# Altium schematic sheet 02_H3CORE.SchDoc
size A2
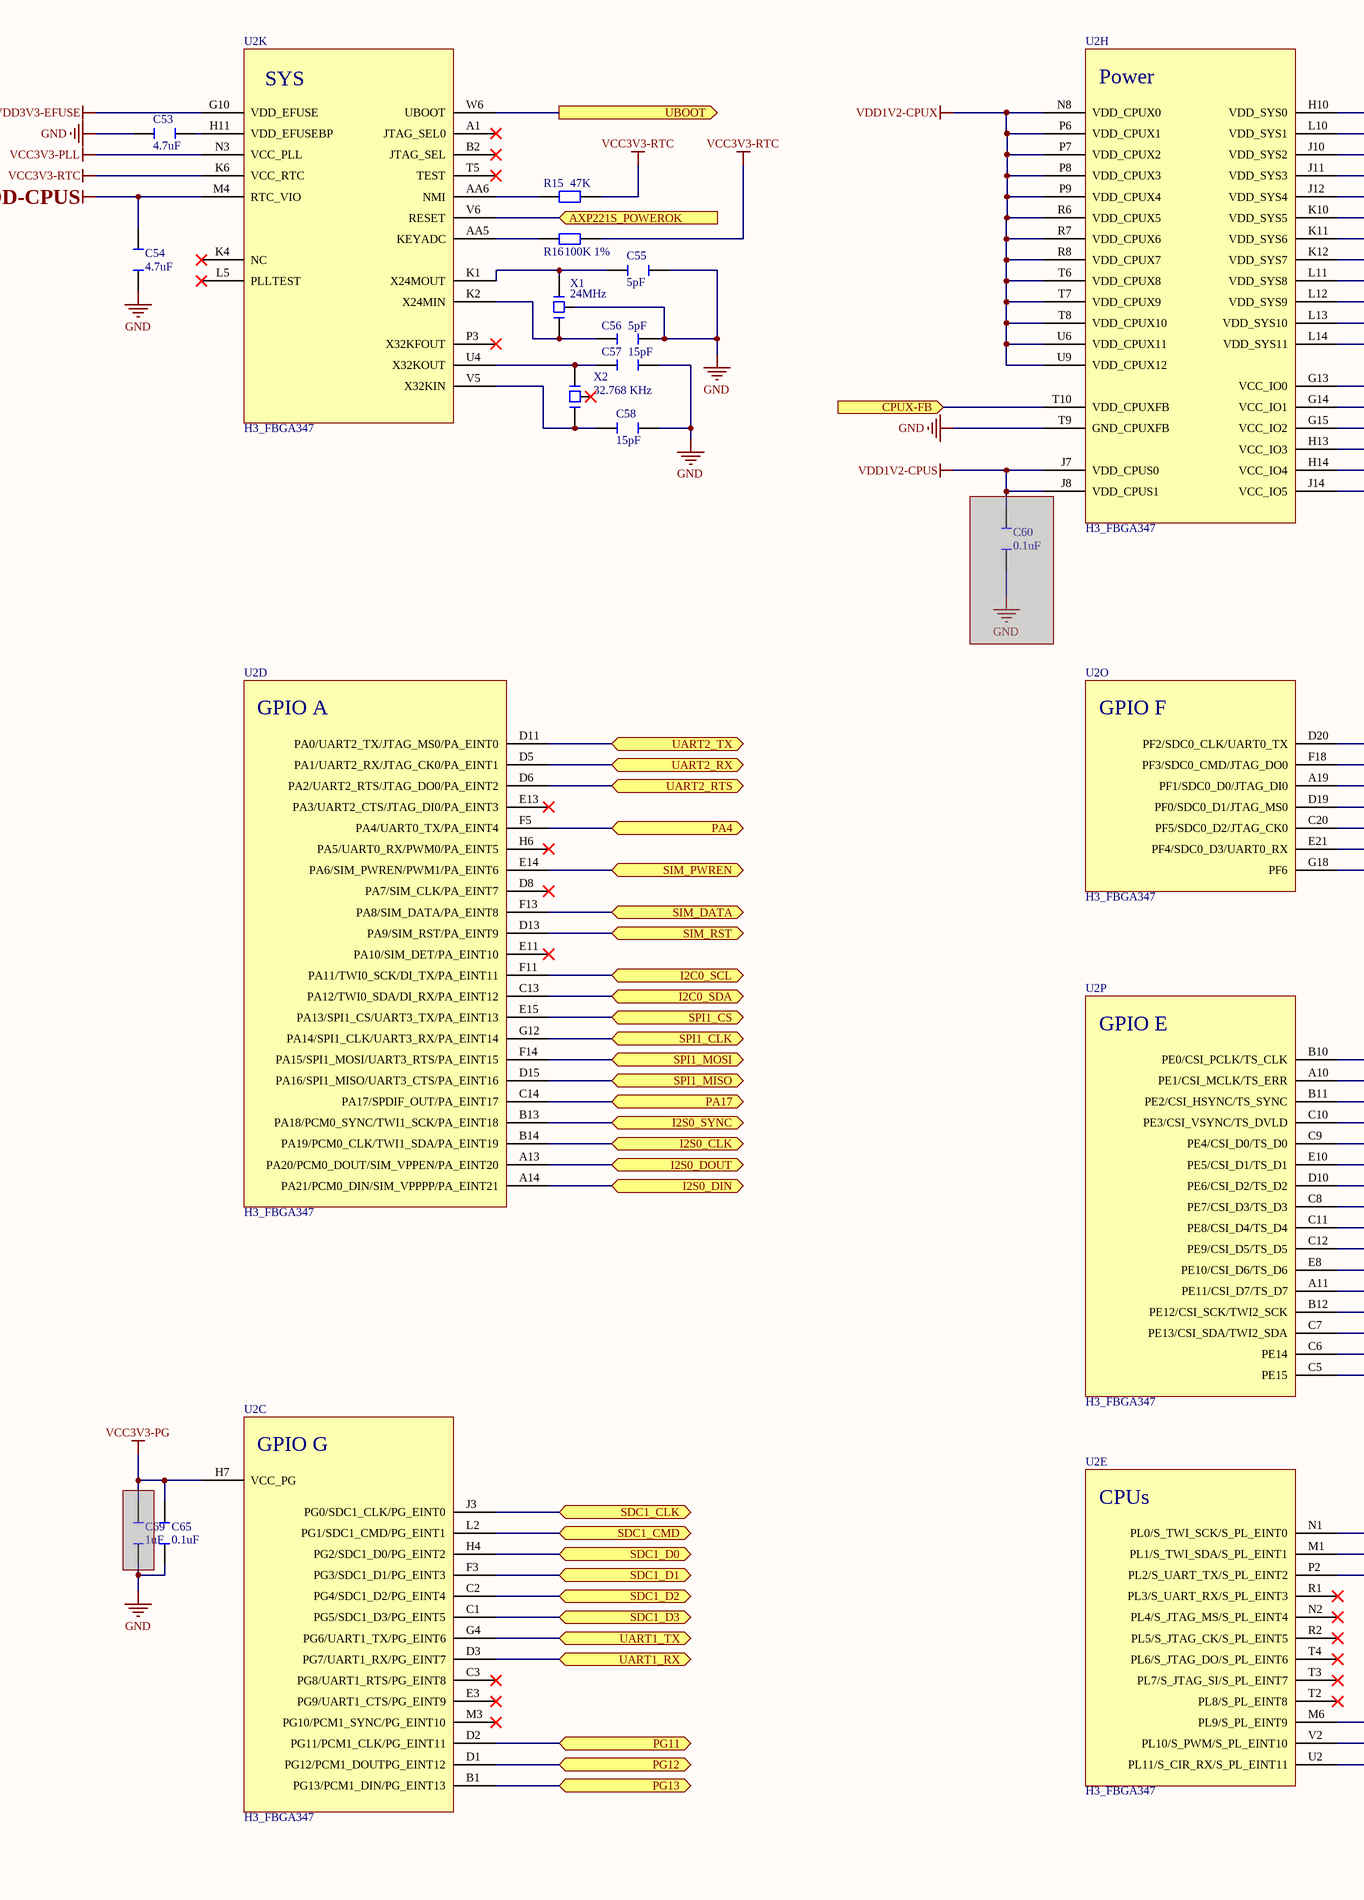
[diagram p0: 02_H3CORE.SchDoc, left]
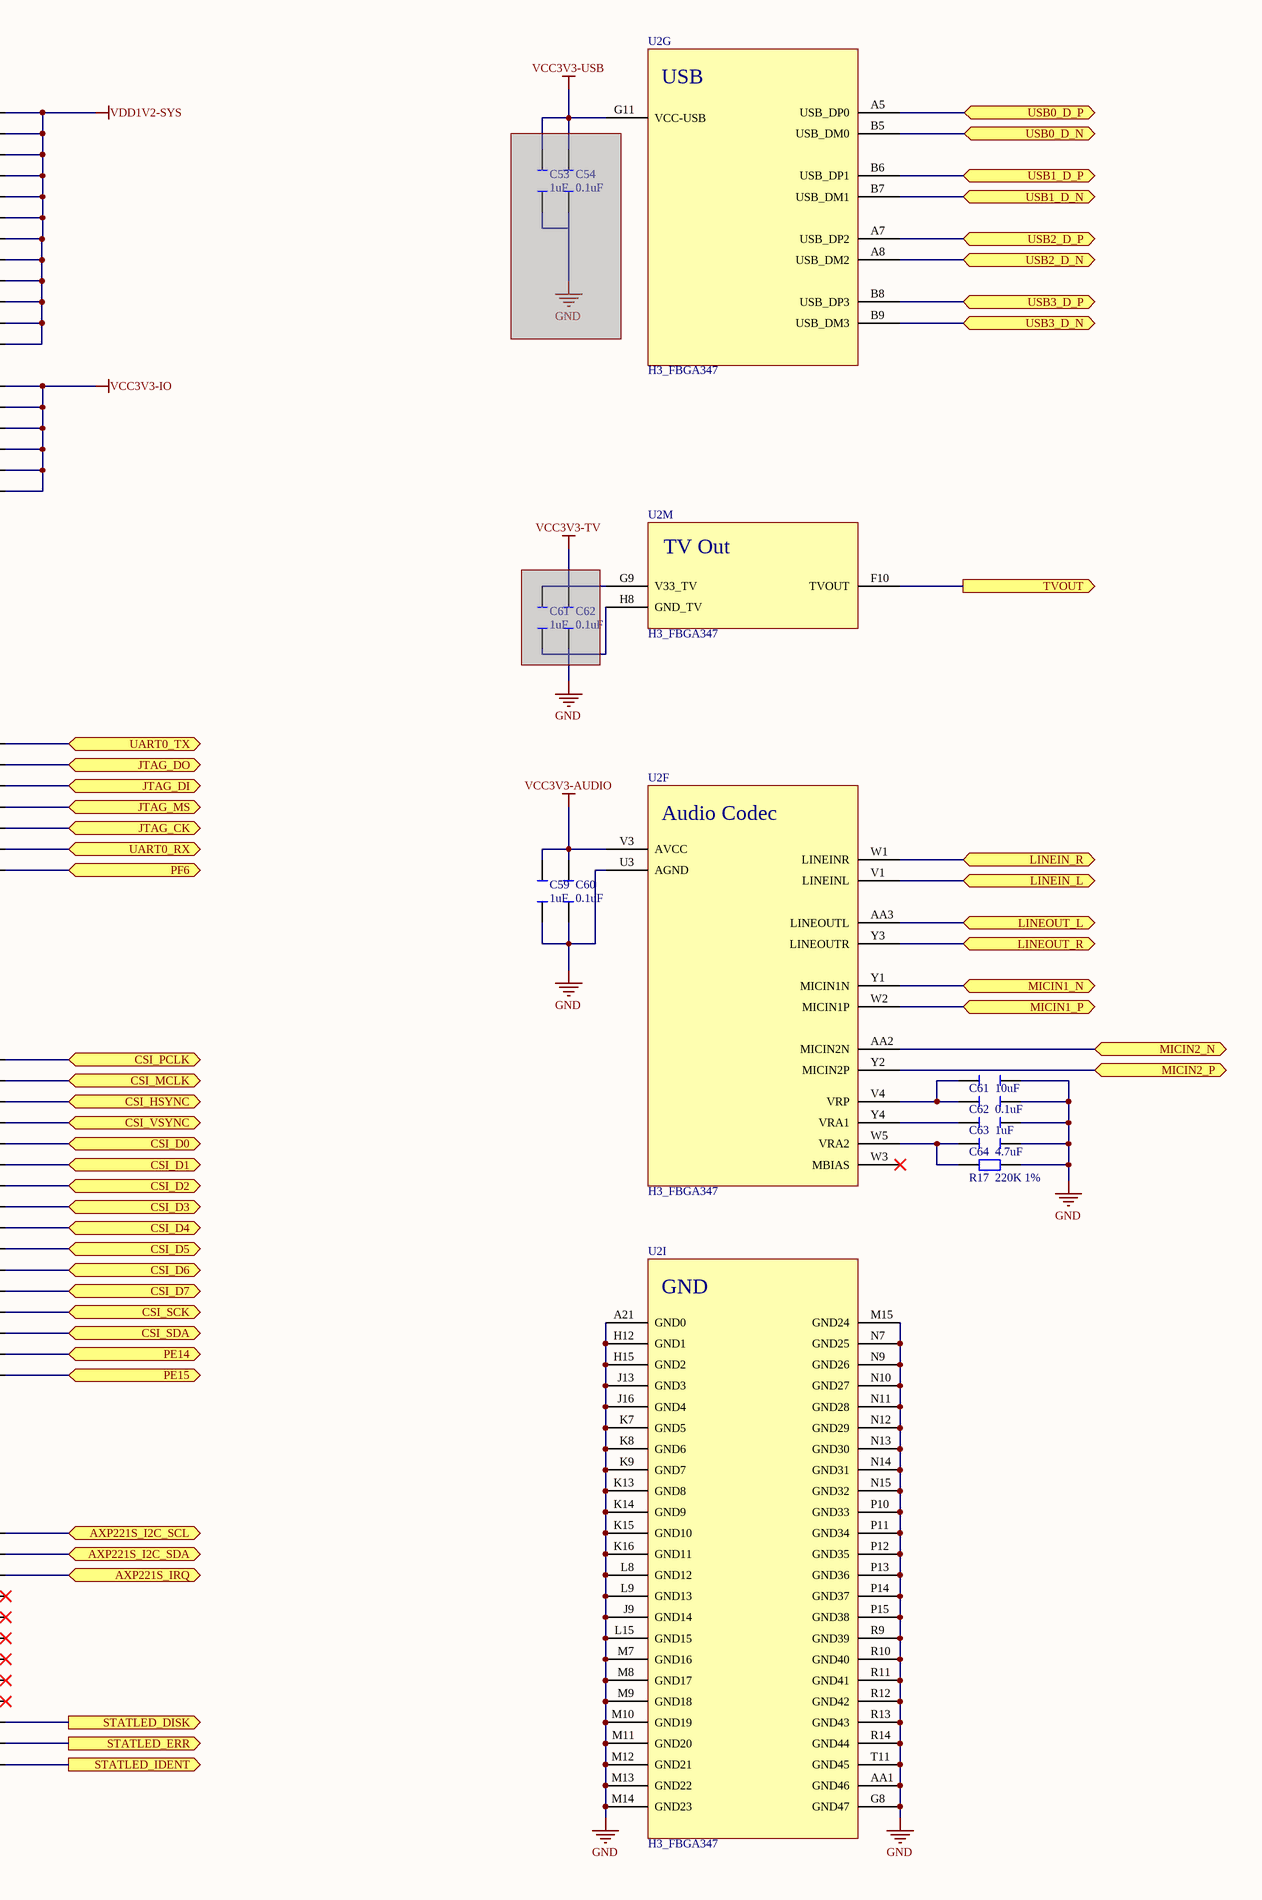
[diagram p1: 02_H3CORE.SchDoc, right]

## Parts
(Parts that share a designator on the sheet are numbered #1, #2 ... from top to bottom, then left to right.)
C53#1  4.7uF  [C0402]
C53#2  1uF  [C0402]  (masked out: inside a compile mask, not in the netlist)
C54#1  0.1uF  [C0402]  (masked out: inside a compile mask, not in the netlist)
C54#2  4.7uF  [C0402]
C55  5pF  [C0402]
C56  5pF  [C0402]
C57  15pF  [C0402]
C58  15pF  [C0402]
C59  1uF  [C0402]
C60#1  0.1uF  [C0402]  (masked out: inside a compile mask, not in the netlist)
C60#2  0.1uF  [C0402]
C61#1  1uF  [C0402]  (masked out: inside a compile mask, not in the netlist)
C61#2  10uF  [C0402]
C62#1  0.1uF  [C0402]  (masked out: inside a compile mask, not in the netlist)
C62#2  0.1uF  [C0402]
C63  1uF  [C0402]
C64  4.7uF  [C0402]
C65  0.1uF  [C0402]
C69  1uF  [C0402]  (masked out: inside a compile mask, not in the netlist)
R15  47K  [R0402]
R16  100K 1%  [R0402]
R17  220K 1%  [R0402]
U2  H3_FBGA347  [H3_FBGA327]  (parts C,D,E,F,G,H,I,K,M,O,P of 16)
X1  24MHz  [SMD3225]
X2  32.768 KHz  [FC_135]

## Ports
AXP221S_I2C_SCL (bidir), AXP221S_I2C_SDA (bidir), AXP221S_IRQ (bidir), AXP221S_POWEROK (in), CPUX-FB (in), CSI_D0 (bidir), CSI_D1 (bidir), CSI_D2 (bidir), CSI_D3 (bidir), CSI_D4 (bidir), CSI_D5 (bidir), CSI_D6 (bidir), CSI_D7 (bidir), CSI_HSYNC (bidir), CSI_MCLK (bidir), CSI_PCLK (bidir), CSI_SCK (bidir), CSI_SDA (bidir), CSI_VSYNC (bidir), I2C0_SCL (bidir), I2C0_SDA (bidir), I2S0_CLK (bidir), I2S0_DIN (bidir), I2S0_DOUT (bidir), I2S0_SYNC (bidir), JTAG_CK (bidir), JTAG_DI (bidir), JTAG_DO (bidir), JTAG_MS (bidir), LINEIN_L (bidir), LINEIN_R (bidir), LINEOUT_L (bidir), LINEOUT_R (bidir), MICIN1_N (bidir), MICIN1_P (bidir), MICIN2_N (bidir), MICIN2_P (bidir), PA4 (bidir), PA17 (bidir), PE14 (bidir), PE15 (bidir), PF6 (bidir), PG11 (bidir), PG12 (bidir), PG13 (bidir), SDC1_CLK (bidir), SDC1_CMD (bidir), SDC1_D0 (bidir), SDC1_D1 (bidir), SDC1_D2 (bidir), SDC1_D3 (bidir), SIM_DATA (bidir), SIM_PWREN (bidir), SIM_RST (bidir), SPI1_CLK (bidir), SPI1_CS (bidir), SPI1_MISO (bidir), SPI1_MOSI (bidir), STATLED_DISK (out), STATLED_ERR (out), STATLED_IDENT (out), TVOUT (out), UART0_RX (bidir), UART0_TX (bidir), UART1_RX (bidir), UART1_TX (bidir), UART2_RTS (bidir), UART2_RX (bidir), UART2_TX (bidir), UBOOT (out), USB0_D_N (bidir), USB0_D_P (bidir), USB1_D_N (bidir), USB1_D_P (bidir), USB2_D_N (bidir), USB2_D_P (bidir), USB3_D_N (bidir), USB3_D_P (bidir)

## Nets
GND: C53#1.1 C54#2.1 C55.2 C56.2 C57.2 C58.2 C59.1 C60#2.1 C61#2.2 C62#2.2 C63.2 C64.2 C65.1 R17.2 U2.A21(GND0) U2.AA1(GND46) U2.G8(GND47) U2.H8(GND_TV) U2.H12(GND1) U2.H15(GND2) U2.J9(GND14) U2.J13(GND3) U2.J16(GND4) U2.K7(GND5) U2.K8(GND6) U2.K9(GND7) U2.K13(GND8) U2.K14(GND9) U2.K15(GND10) U2.K16(GND11) U2.L8(GND12) U2.L9(GND13) U2.L15(GND15) U2.M7(GND16) U2.M8(GND17) U2.M9(GND18) U2.M10(GND19) U2.M11(GND20) U2.M12(GND21) U2.M13(GND22) U2.M14(GND23) U2.M15(GND24) U2.N7(GND25) U2.N9(GND26) U2.N10(GND27) U2.N11(GND28) U2.N12(GND29) U2.N13(GND30) U2.N14(GND31) U2.N15(GND32) U2.P10(GND33) U2.P11(GND34) U2.P12(GND35) U2.P13(GND36) U2.P14(GND37) U2.P15(GND38) U2.R9(GND39) U2.R10(GND40) U2.R11(GND41) U2.R12(GND42) U2.R13(GND43) U2.R14(GND44) U2.T9(GND_CPUXFB) U2.T11(GND45) U2.U3(AGND) X1.3(G)
VCC3V3-AUDIO: C59.2 C60#2.2 U2.V3(AVCC)
VCC3V3-IO: U2.G13(VCC_IO0) U2.G14(VCC_IO1) U2.G15(VCC_IO2) U2.H13(VCC_IO3) U2.H14(VCC_IO4) U2.J14(VCC_IO5)
VCC3V3-PG: C65.2 U2.H7(VCC_PG)
VCC3V3-PLL: U2.N3(VCC_PLL)
VCC3V3-RTC: R15.2 R16.2 U2.K6(VCC_RTC)
VCC3V3-TV: U2.G9(V33_TV)
VCC3V3-USB: U2.G11(VCC-USB)
VDD1V2-CPUS: U2.J7(VDD_CPUS0) U2.J8(VDD_CPUS1)
VDD1V2-CPUX: U2.N8(VDD_CPUX0) U2.P6(VDD_CPUX1) U2.P7(VDD_CPUX2) U2.P8(VDD_CPUX3) U2.P9(VDD_CPUX4) U2.R6(VDD_CPUX5) U2.R7(VDD_CPUX6) U2.R8(VDD_CPUX7) U2.T6(VDD_CPUX8) U2.T7(VDD_CPUX9) U2.T8(VDD_CPUX10) U2.U6(VDD_CPUX11) U2.U9(VDD_CPUX12)
VDD1V2-SYS: U2.H10(VDD_SYS0) U2.J10(VDD_SYS2) U2.J11(VDD_SYS3) U2.J12(VDD_SYS4) U2.K10(VDD_SYS5) U2.K11(VDD_SYS6) U2.K12(VDD_SYS7) U2.L10(VDD_SYS1) U2.L11(VDD_SYS8) U2.L12(VDD_SYS9) U2.L13(VDD_SYS10) U2.L14(VDD_SYS11)
VDD3V3-EFUSE: U2.G10(VDD_EFUSE)
VDD-CPUS: C54#2.2 U2.M4(RTC_VIO)
AXP221S_I2C_SCL: U2.N1(PL0/S_TWI_SCK/S_PL_EINT0) ; port AXP221S_I2C_SCL
AXP221S_I2C_SDA: U2.M1(PL1/S_TWI_SDA/S_PL_EINT1) ; port AXP221S_I2C_SDA
AXP221S_IRQ: U2.P2(PL2/S_UART_TX/S_PL_EINT2) ; port AXP221S_IRQ
AXP221S_POWEROK: U2.V6(RESET) ; port AXP221S_POWEROK
CPUX-FB: U2.T10(VDD_CPUXFB) ; port CPUX-FB
CSI_D0: U2.C9(PE4/CSI_D0/TS_D0) ; port CSI_D0
CSI_D1: U2.E10(PE5/CSI_D1/TS_D1) ; port CSI_D1
CSI_D2: U2.D10(PE6/CSI_D2/TS_D2) ; port CSI_D2
CSI_D3: U2.C8(PE7/CSI_D3/TS_D3) ; port CSI_D3
CSI_D4: U2.C11(PE8/CSI_D4/TS_D4) ; port CSI_D4
CSI_D5: U2.C12(PE9/CSI_D5/TS_D5) ; port CSI_D5
CSI_D6: U2.E8(PE10/CSI_D6/TS_D6) ; port CSI_D6
CSI_D7: U2.A11(PE11/CSI_D7/TS_D7) ; port CSI_D7
CSI_HSYNC: U2.B11(PE2/CSI_HSYNC/TS_SYNC) ; port CSI_HSYNC
CSI_MCLK: U2.A10(PE1/CSI_MCLK/TS_ERR) ; port CSI_MCLK
CSI_PCLK: U2.B10(PE0/CSI_PCLK/TS_CLK) ; port CSI_PCLK
CSI_SCK: U2.B12(PE12/CSI_SCK/TWI2_SCK) ; port CSI_SCK
CSI_SDA: U2.C7(PE13/CSI_SDA/TWI2_SDA) ; port CSI_SDA
CSI_VSYNC: U2.C10(PE3/CSI_VSYNC/TS_DVLD) ; port CSI_VSYNC
I2C0_SCL: U2.F11(PA11/TWI0_SCK/DI_TX/PA_EINT11) ; port I2C0_SCL
I2C0_SDA: U2.C13(PA12/TWI0_SDA/DI_RX/PA_EINT12) ; port I2C0_SDA
I2S0_CLK: U2.B14(PA19/PCM0_CLK/TWI1_SDA/PA_EINT19) ; port I2S0_CLK
I2S0_DIN: U2.A14(PA21/PCM0_DIN/SIM_VPPPP/PA_EINT21) ; port I2S0_DIN
I2S0_DOUT: U2.A13(PA20/PCM0_DOUT/SIM_VPPEN/PA_EINT20) ; port I2S0_DOUT
I2S0_SYNC: U2.B13(PA18/PCM0_SYNC/TWI1_SCK/PA_EINT18) ; port I2S0_SYNC
JTAG_CK: U2.C20(PF5/SDC0_D2/JTAG_CK0) ; port JTAG_CK
JTAG_DI: U2.A19(PF1/SDC0_D0/JTAG_DI0) ; port JTAG_DI
JTAG_DO: U2.F18(PF3/SDC0_CMD/JTAG_DO0) ; port JTAG_DO
JTAG_MS: U2.D19(PF0/SDC0_D1/JTAG_MS0) ; port JTAG_MS
LINEIN_L: U2.V1(LINEINL) ; port LINEIN_L
LINEIN_R: U2.W1(LINEINR) ; port LINEIN_R
LINEOUT_L: U2.AA3(LINEOUTL) ; port LINEOUT_L
LINEOUT_R: U2.Y3(LINEOUTR) ; port LINEOUT_R
MICIN1_N: U2.Y1(MICIN1N) ; port MICIN1_N
MICIN1_P: U2.W2(MICIN1P) ; port MICIN1_P
MICIN2_N: U2.AA2(MICIN2N) ; port MICIN2_N
MICIN2_P: U2.Y2(MICIN2P) ; port MICIN2_P
PA4: U2.F5(PA4/UART0_TX/PA_EINT4) ; port PA4
PA17: U2.C14(PA17/SPDIF_OUT/PA_EINT17) ; port PA17
PE14: U2.C6(PE14) ; port PE14
PE15: U2.C5(PE15) ; port PE15
PF6: U2.G18(PF6) ; port PF6
PG11: U2.D2(PG11/PCM1_CLK/PG_EINT11) ; port PG11
PG12: U2.D1(PG12/PCM1_DOUTPG_EINT12) ; port PG12
PG13: U2.B1(PG13/PCM1_DIN/PG_EINT13) ; port PG13
SDC1_CLK: U2.J3(PG0/SDC1_CLK/PG_EINT0) ; port SDC1_CLK
SDC1_CMD: U2.L2(PG1/SDC1_CMD/PG_EINT1) ; port SDC1_CMD
SDC1_D0: U2.H4(PG2/SDC1_D0/PG_EINT2) ; port SDC1_D0
SDC1_D1: U2.F3(PG3/SDC1_D1/PG_EINT3) ; port SDC1_D1
SDC1_D2: U2.C2(PG4/SDC1_D2/PG_EINT4) ; port SDC1_D2
SDC1_D3: U2.C1(PG5/SDC1_D3/PG_EINT5) ; port SDC1_D3
SIM_DATA: U2.F13(PA8/SIM_DATA/PA_EINT8) ; port SIM_DATA
SIM_PWREN: U2.E14(PA6/SIM_PWREN/PWM1/PA_EINT6) ; port SIM_PWREN
SIM_RST: U2.D13(PA9/SIM_RST/PA_EINT9) ; port SIM_RST
SPI1_CLK: U2.G12(PA14/SPI1_CLK/UART3_RX/PA_EINT14) ; port SPI1_CLK
SPI1_CS: U2.E15(PA13/SPI1_CS/UART3_TX/PA_EINT13) ; port SPI1_CS
SPI1_MISO: U2.D15(PA16/SPI1_MISO/UART3_CTS/PA_EINT16) ; port SPI1_MISO
SPI1_MOSI: U2.F14(PA15/SPI1_MOSI/UART3_RTS/PA_EINT15) ; port SPI1_MOSI
STATLED_DISK: U2.M6(PL9/S_PL_EINT9) ; port STATLED_DISK
STATLED_ERR: U2.V2(PL10/S_PWM/S_PL_EINT10) ; port STATLED_ERR
STATLED_IDENT: U2.U2(PL11/S_CIR_RX/S_PL_EINT11) ; port STATLED_IDENT
TVOUT: U2.F10(TVOUT) ; port TVOUT
UART0_RX: U2.E21(PF4/SDC0_D3/UART0_RX) ; port UART0_RX
UART0_TX: U2.D20(PF2/SDC0_CLK/UART0_TX) ; port UART0_TX
UART1_RX: U2.D3(PG7/UART1_RX/PG_EINT7) ; port UART1_RX
UART1_TX: U2.G4(PG6/UART1_TX/PG_EINT6) ; port UART1_TX
UART2_RTS: U2.D6(PA2/UART2_RTS/JTAG_DO0/PA_EINT2) ; port UART2_RTS
UART2_RX: U2.D5(PA1/UART2_RX/JTAG_CK0/PA_EINT1) ; port UART2_RX
UART2_TX: U2.D11(PA0/UART2_TX/JTAG_MS0/PA_EINT0) ; port UART2_TX
UBOOT: U2.W6(UBOOT) ; port UBOOT
USB0_D_N: U2.B5(USB_DM0) ; port USB0_D_N
USB0_D_P: U2.A5(USB_DP0) ; port USB0_D_P
USB1_D_N: U2.B7(USB_DM1) ; port USB1_D_N
USB1_D_P: U2.B6(USB_DP1) ; port USB1_D_P
USB2_D_N: U2.A8(USB_DM2) ; port USB2_D_N
USB2_D_P: U2.A7(USB_DP2) ; port USB2_D_P
USB3_D_N: U2.B9(USB_DM3) ; port USB3_D_N
USB3_D_P: U2.B8(USB_DP3) ; port USB3_D_P
NetC53#1_2: C53#1.2 U2.H11(VDD_EFUSEBP)
NetC55_1: C55.1 U2.K1(X24MOUT) X1.2(OUT)
NetC56_1: C56.1 U2.K2(X24MIN) X1.1(IN)
NetC57_1: C57.1 U2.U4(X32KOUT) X2.2(OUT)
NetC58_1: C58.1 U2.V5(X32KIN) X2.1(IN)
NetC61#2_1: C61#2.1 C62#2.1 U2.V4(VRP)
NetC63_1: C63.1 U2.Y4(VRA1)
NetC64_1: C64.1 R17.1 U2.W5(VRA2)
NetR15_1: R15.1 U2.AA6(NMI)
NetR16_1: R16.1 U2.AA5(KEYADC)

Not connected (* = marked no-connect by the designer): U2 A1(JTAG_SEL0)* B2(JTAG_SEL)* C3(PG8/UART1_RTS/PG_EINT8)* D8(PA7/SIM_CLK/PA_EINT7)* E3(PG9/UART1_CTS/PG_EINT9)* E11(PA10/SIM_DET/PA_EINT10)* E13(PA3/UART2_CTS/JTAG_DI0/PA_EINT3)* H6(PA5/UART0_RX/PWM0/PA_EINT5)* K4(NC)* L5(PLLTEST)* M3(PG10/PCM1_SYNC/PG_EINT10)* N2(PL4/S_JTAG_MS/S_PL_EINT4)* P3(X32KFOUT)* R1(PL3/S_UART_RX/S_PL_EINT3)* R2(PL5/S_JTAG_CK/S_PL_EINT5)* T2(PL8/S_PL_EINT8)* T3(PL7/S_JTAG_SI/S_PL_EINT7)* T4(PL6/S_JTAG_DO/S_PL_EINT6)* T5(TEST)* W3(MBIAS)*; X2 3(G)*

## Notes on the sheet
- (in symbol H3_FBGA347, part C) GPIO G
- (in symbol H3_FBGA347, part D) GPIO A
- (in symbol H3_FBGA347, part E) CPUs
- (in symbol H3_FBGA347, part F) Audio Codec
- (in symbol H3_FBGA347, part G) USB
- (in symbol H3_FBGA347, part H) Power
- (in symbol H3_FBGA347, part I) GND
- (in symbol H3_FBGA347, part K) SYS
- (in symbol H3_FBGA347, part M) TV Out
- (in symbol H3_FBGA347, part O) GPIO F
- (in symbol H3_FBGA347, part P) GPIO E

## Library data of the parts
C53#1 C54#2 C64 = C_4.7UF
C53#2 C59 C61#1 C63 C69 = C_1UF
C54#1 C60#1 C60#2 C62#1 C62#2 C65 = C_0.1UF
C55 C56 = C_5PF
C57 C58 = C_15PF
C61#2 = C_10UF
R15 = R_47K
R16 = R_100K_P1
R17 = R_220K_P1
X1 = X_24MHZ
X2 = X_32768HZ